# EAGLE design LED_CUBE_V4 (EAGLE 8.4.0)
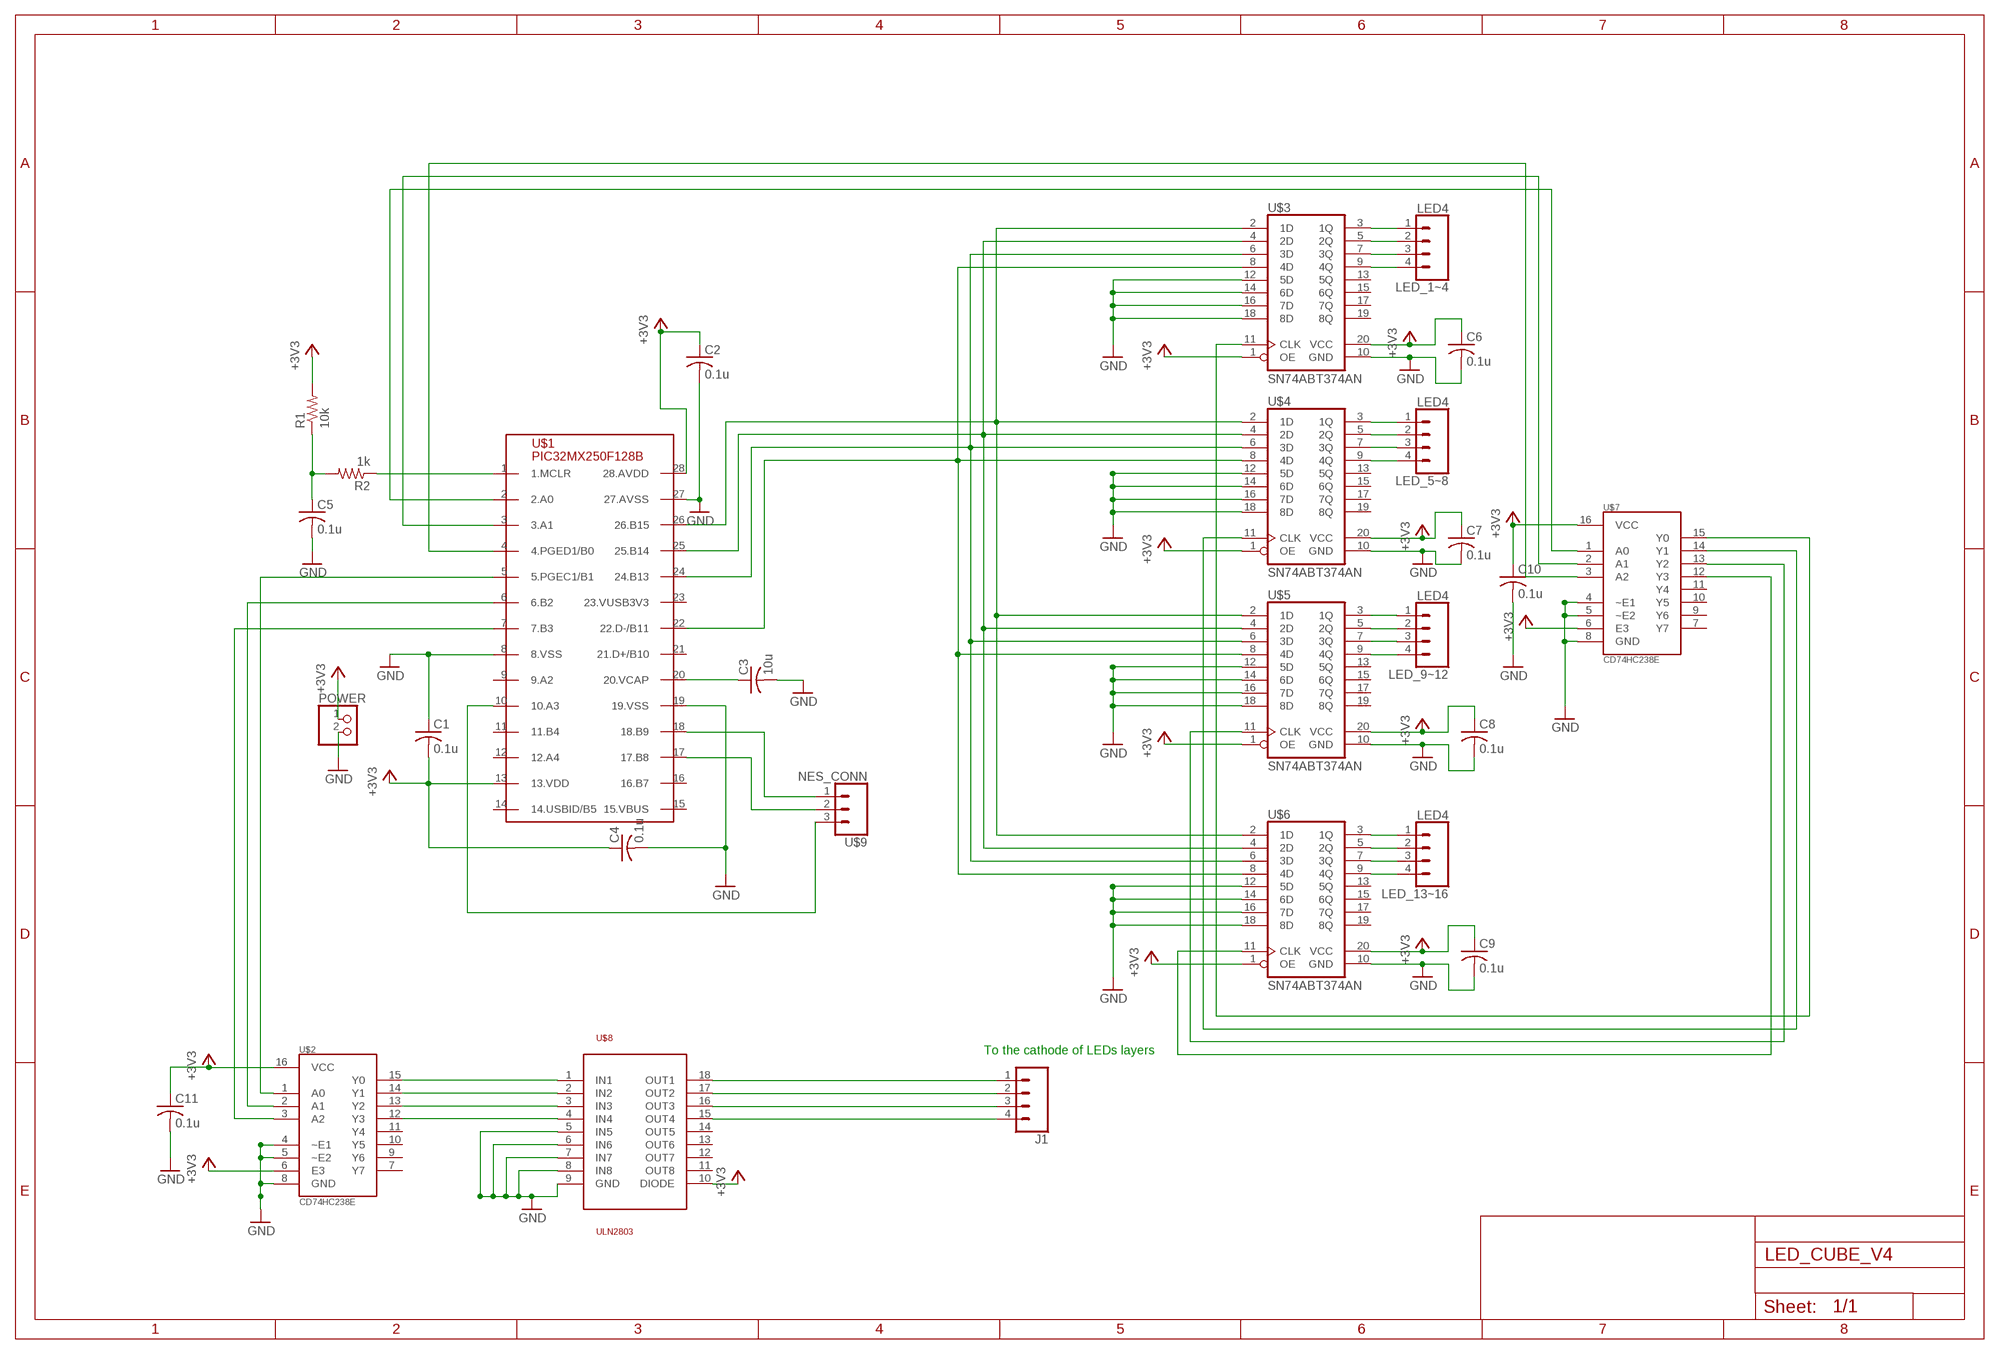
[diagram p0: schematic, sheet 1]

## Parts
C1  0.1u  C-US025-025X050  [C025-025X050]
C2  0.1u  C-US025-025X050  [C025-025X050]
C3  10u  C-US025-025X050  [C025-025X050]
C4  0.1u  C-US025-025X050  [C025-025X050]
C5  0.1u  C-US025-025X050  [C025-025X050]
C6  0.1u  C-US025-025X050  [C025-025X050]
C7  0.1u  C-US025-025X050  [C025-025X050]
C8  0.1u  C-US025-025X050  [C025-025X050]
C9  0.1u  C-US025-025X050  [C025-025X050]
C10  0.1u  C-US025-025X050  [C025-025X050]
C11  0.1u  C-US025-025X050  [C025-025X050]
J1  CONN_04  [1X04]
LED_1~4  LED4  [1X04]
LED_5~8  LED4  [1X04]
LED_9~12  LED4  [1X04]
LED_13~16  LED4  [1X04]
POWER  PINHD-1X2  [1X02]
R1  10k  R-US_0204/7  [0204/7]
R2  1k  R-US_0204/7  [0204/7]
U$1  PIC32MX250F128B  [DIL28-3]
U$2  CD74HC238E  [DIL16]
U$3  SN74ABT374AN  [DIL20]
U$4  SN74ABT374AN  [DIL20]
U$5  SN74ABT374AN  [DIL20]
U$6  SN74ABT374AN  [DIL20]
U$7  CD74HC238E  [DIL16]
U$8  ULN2803  [SO18L]
U$9  NES_CONN  [1X03]

## Nets
+3V3: C1.2 C2.1 C4.1 C6.1 C7.1 C8.1 C9.1 C10.1 C11.1 POWER.1 R1.2 U$1.13(13.VDD) U$1.28(28.AVDD) U$2.6(E3) U$2.16(VCC) U$3.1(OE) U$3.20(VCC) U$4.1(OE) U$4.20(VCC) U$5.1(OE) U$5.20(VCC) U$6.1(OE) U$6.20(VCC) U$7.6(E3) U$7.16(VCC) U$8.10(DIODE)
GND: C1.1 C2.2 C3.2 C4.2 C5.2 C6.2 C7.2 C8.2 C9.2 C10.2 C11.2 POWER.2 U$1.8(8.VSS) U$1.19(19.VSS) U$1.27(27.AVSS) U$2.4(~E1) U$2.5(~E2) U$2.8(GND) U$3.10(GND) U$3.12(5D) U$3.14(6D) U$3.16(7D) U$3.18(8D) U$4.10(GND) U$4.12(5D) U$4.14(6D) U$4.16(7D) U$4.18(8D) U$5.10(GND) U$5.12(5D) U$5.14(6D) U$5.16(7D) U$5.18(8D) U$6.10(GND) U$6.12(5D) U$6.14(6D) U$6.16(7D) U$6.18(8D) U$7.4(~E1) U$7.5(~E2) U$7.8(GND) U$8.5(IN5) U$8.6(IN6) U$8.7(IN7) U$8.8(IN8) U$8.9(GND)
LED1: LED_1~4.1 U$3.3(1Q)
N$1: U$2.15(Y0) U$8.1(IN1)
N$2: U$2.14(Y1) U$8.2(IN2)
N$3: U$2.13(Y2) U$8.3(IN3)
N$4: U$2.12(Y3) U$8.4(IN4)
N$5: U$1.10(10.A3) U$9.3
N$6: U$1.17(17.B8) U$9.2
N$7: U$1.18(18.B9) U$9.1
N$9: J1.1 U$8.18(OUT1)
N$10: J1.2 U$8.17(OUT2)
N$11: J1.3 U$8.16(OUT3)
N$12: J1.4 U$8.15(OUT4)
N$16: C3.1 U$1.20(20.VCAP)
N$17: U$1.5(5.PGEC1/B1) U$2.1(A0)
N$18: U$1.6(6.B2) U$2.2(A1)
N$19: U$1.7(7.B3) U$2.3(A2)
N$20: LED_9~12.1 U$5.3(1Q)
N$22: U$1.26(26.B15) U$3.2(1D) U$4.2(1D) U$5.2(1D) U$6.2(1D)
N$23: U$1.25(25.B14) U$3.4(2D) U$4.4(2D) U$5.4(2D) U$6.4(2D)
N$24: U$1.22(22.D-/B11) U$3.8(4D) U$4.8(4D) U$5.8(4D) U$6.8(4D)
N$25: U$1.24(24.B13) U$3.6(3D) U$4.6(3D) U$5.6(3D) U$6.6(3D)
N$28: C5.1 R1.1 R2.2
N$29: R2.1 U$1.1(1.MCLR)
N$31: U$3.11(CLK) U$7.15(Y0)
N$32: U$4.11(CLK) U$7.14(Y1)
N$33: U$1.3(3.A1) U$7.2(A1)
N$34: U$1.4(4.PGED1/B0) U$7.3(A2)
N$35: U$5.11(CLK) U$7.13(Y2)
N$36: U$6.11(CLK) U$7.12(Y3)
N$38: LED_9~12.2 U$5.5(2Q)
N$39: U$1.2(2.A0) U$7.1(A0)
N$40: LED_1~4.2 U$3.5(2Q)
N$41: LED_1~4.3 U$3.7(3Q)
N$42: LED_1~4.4 U$3.9(4Q)
N$43: LED_9~12.3 U$5.7(3Q)
N$44: LED_9~12.4 U$5.9(4Q)
N$47: LED_5~8.1 U$4.3(1Q)
N$48: LED_5~8.2 U$4.5(2Q)
N$49: LED_5~8.3 U$4.7(3Q)
N$50: LED_5~8.4 U$4.9(4Q)
N$63: LED_13~16.1 U$6.3(1Q)
N$64: LED_13~16.2 U$6.5(2Q)
N$65: LED_13~16.3 U$6.7(3Q)
N$66: LED_13~16.4 U$6.9(4Q)
Unconnected: U$1.9(9.A2) U$1.11(11.B4) U$1.12(12.A4) U$1.14(14.USBID/B5) U$1.15(15.VBUS) U$1.16(16.B7) U$1.21(21.D+/B10) U$1.23(23.VUSB3V3) U$2.7(Y7) U$2.9(Y6) U$2.10(Y5) U$2.11(Y4) U$3.13(5Q) U$3.15(6Q) U$3.17(7Q) U$3.19(8Q) U$4.13(5Q) U$4.15(6Q) U$4.17(7Q) U$4.19(8Q) U$5.13(5Q) U$5.15(6Q) U$5.17(7Q) U$5.19(8Q) U$6.13(5Q) U$6.15(6Q) U$6.17(7Q) U$6.19(8Q) U$7.7(Y7) U$7.9(Y6) U$7.10(Y5) U$7.11(Y4) U$8.11(OUT8) U$8.12(OUT7) U$8.13(OUT6) U$8.14(OUT5)

## Notes on the sheet
- To the cathode of LEDs layers

## Library data of the parts
C1-C11 = resistor:C-US: CAPACITOR, American symbol
J1 = SparkFun-Connectors:CONN_04: Multi connection point. Often used as Generic Header-pin footprint for 0.1 inch spaced/style header connections On any of the 0.1 inch spaced packages, you can populate with these: Break Away Headers - Straight <https://www.sparkfun.com/products/116> (PRT-00116) Break Away Male Headers - Right Angle <https://www.sparkfun.com/products/553> (PRT-00553) Female Headers <https://www.sparkfun.com/products/115> (PRT-00115) Break Away Headers - Machine Pin <https://www.sparkfun.com/products/117> (PRT-00117) Break Away Female Headers - Swiss Machine Pin <https://www.sparkfun.com/products/743> (PRT-00743) For SCREWTERMINALS and SPRING TERMINALS visit here: Screw Terimnals on SparkFun.com <https://www.sparkfun.com/search/results?term=Screw+Terminals> (5mm/3.5mm/2.54mm spacing) This device is also useful as a general connection point to wire up your design to another part of your project. Our various solder wires solder well into these plated through hole pads. Hook-Up Wire - Assortment (Stranded, 22 AWG) <https://www.sparkfun.com/products/11375> (PRT-11375) Hook-Up Wire - Assortment (Solid Core, 22 AWG) <https://www.sparkfun.com/products/11367> (PRT-11367) View the entire wire category on our website here <https://www.sparkfun.com/categories/141> Special notes: Molex polarized connector foot print use with SKU : PRT-08231 with associated crimp pins and housings. 1MM SMD Version SKU: PRT-10208; PROD_ID: CONN-09696
LED_1~4 LED_5~8 LED_9~12 LED_13~16 = ECE411:LED4
POWER = pinhead:PINHD-1X2: PIN HEADER
R1 R2 = resistor:R-US_: RESISTOR, American symbol
U$1 = ECE411:PIC32MX250F128B
U$2 U$7 = ECE411:CD74HC238E
U$3-U$6 = ECE411:SN74ABT374AN
U$8 = uln2803:ULN2803
U$9 = ECE411:NES_CONN

## Net classes
0 default: width 0.305 mm, drill 0.508 mm, clearance 0.254 mm

## Board
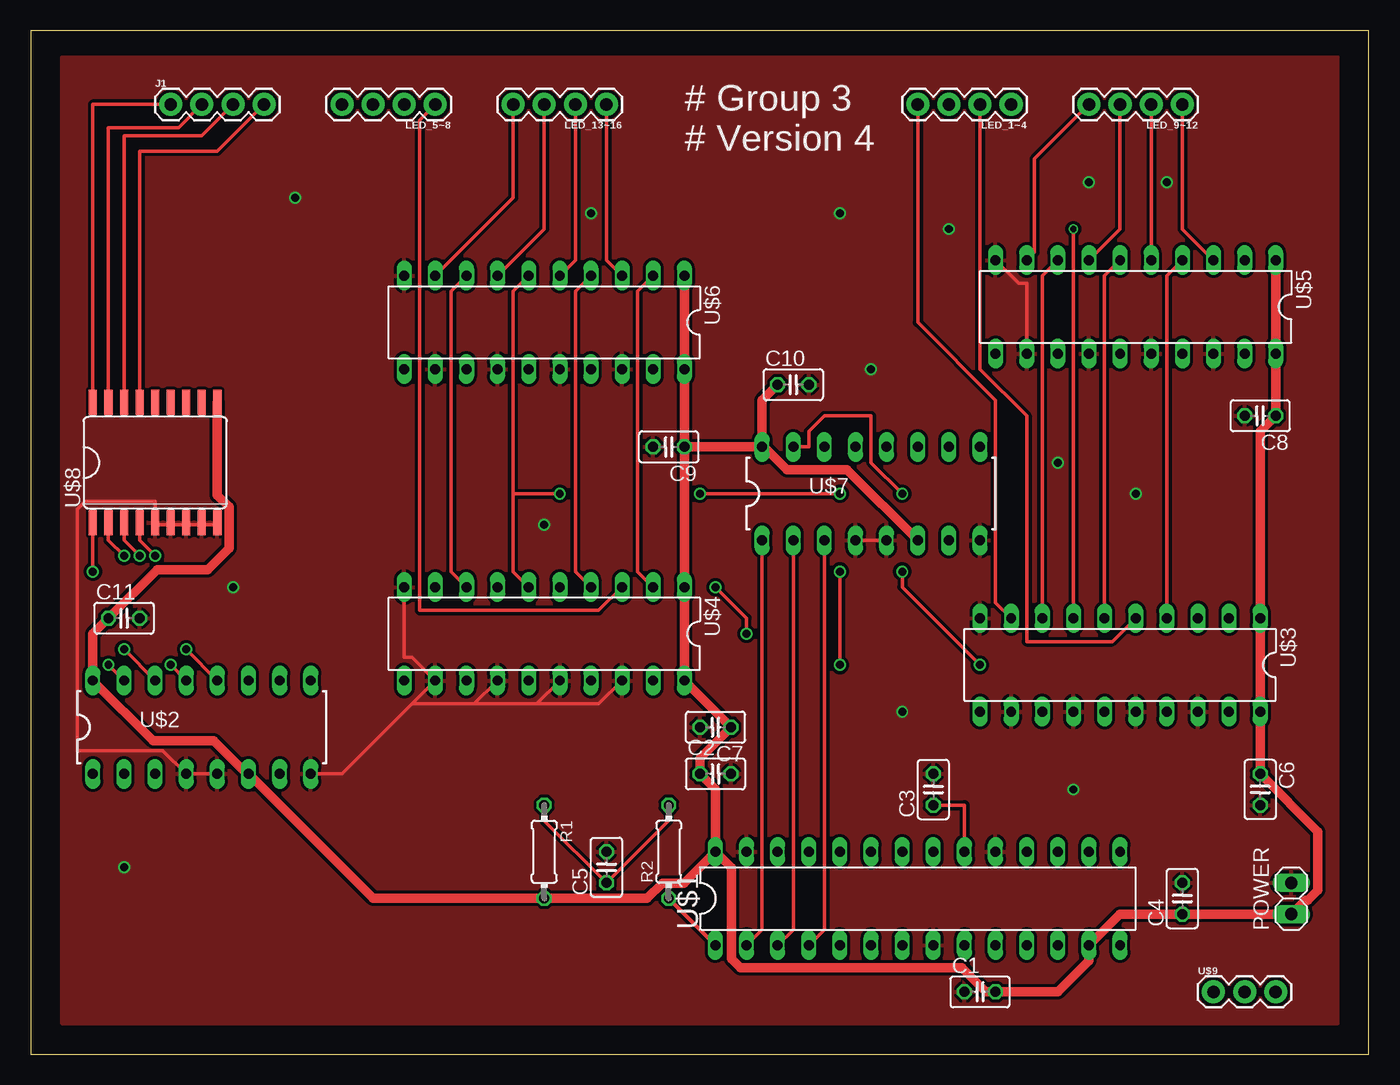
[diagram p1: board, top side]
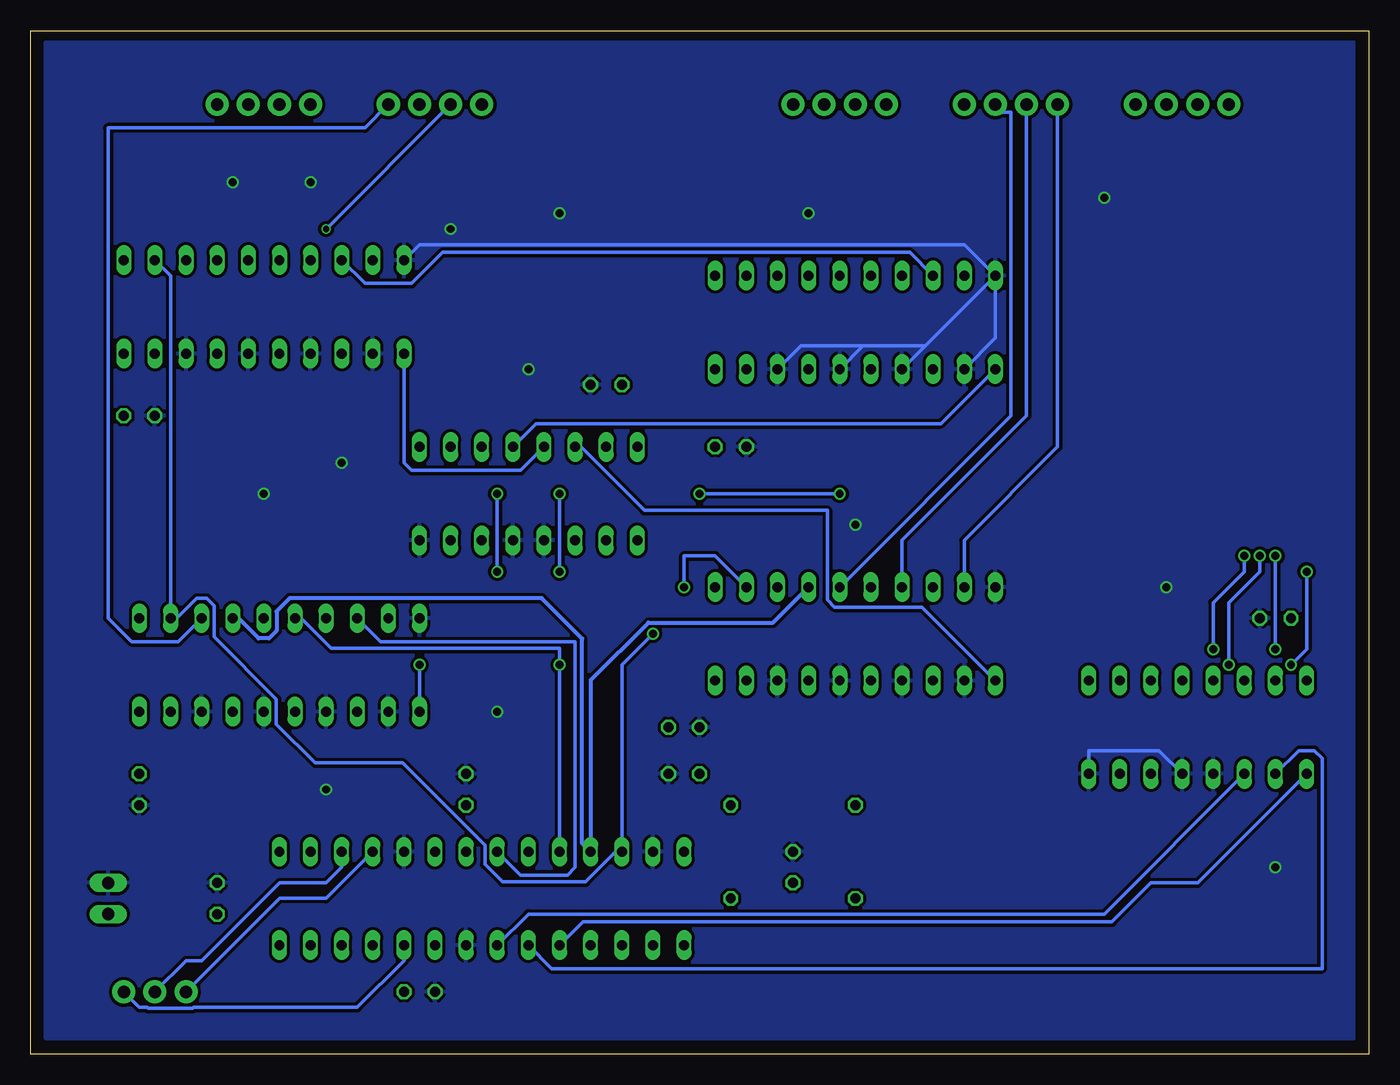
[diagram p2: board, bottom side, seen from below]

Size 109.2 x 83.49 mm. Coordinates in mm from the lower left corner, seen from the top.
Outline: 0,0 109.2,0 109.2,83.49 0,83.49 0,0
Copper layers (1*16): Top 0.035559375mm / dielectric 1.6mm / Bottom 0.035559375mm
Design rules "oshpark-2layer": minimum track width 6mil, minimum drill 10mil, track to track 6mil, track to pad 6mil, pad to pad 6mil, via to via 6mil, smd to smd 6mil, copper to edge 15mil, drill to drill 6mil, minimum pad ring 5mil, minimum via ring 5mil, stop-mask expansion 2.5mil, vias tented up to drill 0mil, thermal gap 10mil

### Footprints (pad centres in the part's own frame; a part is rotated, then mirrored left to right if it is on the bottom)
C025-025X050 = drill 0.813 octagon: 1 -1.27,0; 2 1.27,0
1X04 = drill 1.016 pad 1.88: 1 0,0; 2 2.54,0; 3 5.08,0; 4 7.62,0
1X02 = drill 1.016 long: 1 -1.27,0; 2 1.27,0
0204/7 = drill 0.813 octagon: 1 -3.81,0; 2 3.81,0
DIL28-3 = drill 0.813 long: 1 -16.51,-3.81; 2 -13.97,-3.81; 3 -11.43,-3.81; 4 -8.89,-3.81; 5 -6.35,-3.81; 6 -3.81,-3.81; 7 -1.27,-3.81; 8 1.27,-3.81; 9 3.81,-3.81; 10 6.35,-3.81; 11 8.89,-3.81; 12 11.43,-3.81; 13 13.97,-3.81; 14 16.51,-3.81; 15 16.51,3.81; 16 13.97,3.81; 17 11.43,3.81; 18 8.89,3.81; 19 6.35,3.81; 20 3.81,3.81; 21 1.27,3.81; 22 -1.27,3.81; 23 -3.81,3.81; 24 -6.35,3.81; 25 -8.89,3.81; 26 -11.43,3.81; 27 -13.97,3.81; 28 -16.51,3.81
DIL16 = drill 0.813 long: 1 -8.89,-3.81; 2 -6.35,-3.81; 3 -3.81,-3.81; 4 -1.27,-3.81; 5 1.27,-3.81; 6 3.81,-3.81; 7 6.35,-3.81; 8 8.89,-3.81; 9 8.89,3.81; 10 6.35,3.81; 11 3.81,3.81; 12 1.27,3.81; 13 -1.27,3.81; 14 -3.81,3.81; 15 -6.35,3.81; 16 -8.89,3.81
DIL20 = drill 0.813 long: 1 -11.43,-3.81; 2 -8.89,-3.81; 3 -6.35,-3.81; 4 -3.81,-3.81; 5 -1.27,-3.81; 6 1.27,-3.81; 7 3.81,-3.81; 8 6.35,-3.81; 9 8.89,-3.81; 10 11.43,-3.81; 11 11.43,3.81; 12 8.89,3.81; 13 6.35,3.81; 14 3.81,3.81; 15 1.27,3.81; 16 -1.27,3.81; 17 -3.81,3.81; 18 -6.35,3.81; 19 -8.89,3.81; 20 -11.43,3.81
SO18L = smd 0.66 x 2.032: 1 -5.08,-4.902; 2 -3.81,-4.902; 3 -2.54,-4.902; 4 -1.27,-4.902; 5 0,-4.902; 6 1.27,-4.902; 7 2.54,-4.902; 8 3.81,-4.902; 9 5.08,-4.902; 10 5.08,4.902; 11 3.81,4.902; 12 2.54,4.902; 13 1.27,4.902; 14 0,4.902; 15 -1.27,4.902; 16 -2.54,4.902; 17 -3.81,4.902; 18 -5.08,4.902
1X03 = drill 1.016 pad 1.88: 1 0,0; 2 2.54,0; 3 5.08,0

### Placement (x,y rotation side)
C1  77.47,5.08 0 top
C2  55.88,22.86 0 top
C3  73.66,21.59 90 top
C4  93.98,12.7 90 top
C5  46.99,15.24 90 top
C6  100.33,21.59 270 top
C7  55.88,26.67 180 top
C8  100.33,52.07 180 top
C9  52.07,49.53 180 top
C10  62.23,54.61 0 top
C11  7.62,35.56 0 top
J1  11.43,77.47 0 top
LED_1~4  80.01,77.47 180 top
LED_5~8  33.02,77.47 180 top
LED_9~12  93.98,77.47 180 top
LED_13~16  46.99,77.47 180 top
POWER  102.87,12.7 90 top
R1  41.91,16.51 270 top
R2  52.07,16.51 90 top
U$1  72.39,12.7 0 top
U$2  13.97,26.67 0 top
U$3  88.9,31.75 180 top
U$4  41.91,34.29 180 top
U$5  90.17,60.96 180 top
U$6  41.91,59.69 180 top
U$7  68.58,45.72 0 top
U$8  10.16,48.26 0 top
U$9  96.52,5.08 0 top

### Tracks (layer width: path | path; a pad name or v marks a point on that pad's centre or on a via)
+3V3
  Top 0.762: U$1.28 55.88,21.59 C2.1 54.61,24.13 C7.1 U$4.20 U$4.1 C9.1 | C9.1 U$6.20 U$6.1 | U$7.16 59.69,53.34 C10.1 | U$5.1 U$5.20 C8.1 100.33,50.8 U$3.1 U$3.20 C6.1 105.03,18.16 105.03,13.39 104.21,12.57 104.01,12.57 POWER.1 C4.1 88.9,11.43 U$1.13 86.36,7.62 83.82,5.08 C1.2 77.96,5.08 76,7.04 57.9,7.04 57.17,7.76 57.17,15.21 U$1.28 | U$7.16 C9.1 | U$7.16 59.86,49.53 61.71,47.68 66.62,47.68 U$7.6 | U$1.28 53.31,13.95 51.55,13.95 50.31,12.7 R1.2 27.94,12.7 U$2.6 17.61,22.86 14.92,25.55 10.01,25.55 U$2.16 5.08,34.29 C11.1 10.31,39.52 14.44,39.52 16.2,41.29 16.2,44.64 15.24,45.6 U$8.10
GND  (via drill 0.65)
  Top 0.305: U$2.5 U$2.4 10.79,24.77 3.81,24.77 3.81,44.45 4.45,45.09 10.16,45.09 U$8.5 10.16,43.18 11.43,43.18 | 31.11,28.57 25.4,22.86 U$2.8 | 31.11,28.57 U$4.12 31.11,32.38 30.48,32.38 U$4.10 | 36.2,28.57 U$4.14 | 31.11,28.57 36.2,28.57 | 41.27,28.57 U$4.16 | 36.2,28.57 41.27,28.57 | U$4.18 46.35,28.57 41.27,28.57 | U$5.12 81.28,62.87 80.64,62.87 U$5.10 | 11.43,43.18 12.7,43.18 | 11.43,43.18 U$8.6 | 12.7,43.18 13.97,43.18 | 12.7,43.18 U$8.7 | 13.97,43.18 15.24,43.18 U$8.9 | 13.97,43.18 U$8.8 | U$7.5 U$7.4
  Bottom 0.305: U$5.10 77.47,66.04 33.02,66.04 U$6.10 | U$6.12 30.48,58.42 U$6.10 | U$6.10 36.2,57.78 | 36.2,57.78 U$6.14 | 41.27,57.78 U$6.16 | 36.2,57.78 41.27,57.78 | U$6.18 46.35,57.78 41.27,57.78 | U$2.5 17.14,24.77 22.86,24.77 U$2.8
  other vias: 66.04,68.58 85.09,21.59 16.51,38.1 7.62,15.24 21.59,69.85 74.93,67.31 90.17,45.72 71.12,27.94 68.58,55.88 45.72,68.58 41.91,43.18 86.36,71.12 92.71,71.12 83.82,48.26
  pour Top: 2.54,78.74 2.54,2.54 106.68,2.54 106.68,81.28 87.63,81.28 2.54,81.28
  pour Bottom: 1.27,82.55 1.27,1.27 2.54,1.27 107.95,1.27 107.95,82.55 105.41,82.55
LED1
  Bottom 0.305: U$3.3 97.16,33.66 100.97,33.66 102.87,35.56 102.87,75.56 81.92,75.56 LED_1~4.1
N$1  (via drill 0.65)
  Top 0.305: v6.35,31.75 U$2.15 | U$8.1 v5.08,39.37
  Bottom 0.305: v6.35,31.75 5.08,33.02 v5.08,39.37
N$2  (via drill 0.65)
  Top 0.305: v7.62,33.02 U$2.14 | v7.62,40.64 6.35,41.91 U$8.2
  Bottom 0.305: v7.62,40.64 v7.62,33.02
N$3  (via drill 0.65)
  Top 0.305: v11.43,31.75 U$2.13 | v8.89,40.64 7.62,41.91 U$8.3
  Bottom 0.305: v11.43,31.75 11.43,36.83 8.89,39.37 v8.89,40.64
N$4  (via drill 0.65)
  Top 0.305: v12.7,33.02 U$2.12 | v10.16,40.64 8.89,41.91 U$8.4
  Bottom 0.305: v12.7,33.02 12.7,36.83 10.16,39.37 v10.16,40.64
N$5
  Bottom 0.305: U$9.3 100.33,3.81 99.69,3.81 99.62,3.73 95.96,3.73 95.89,3.81 82.55,3.81 78.74,7.62 U$1.10
N$6
  Bottom 0.305: U$9.2 96.52,7.62 95.25,7.62 88.9,13.97 85.09,13.97 83.82,15.24 U$1.17
N$7
  Bottom 0.305: U$1.18 85.09,12.7 88.9,12.7 U$9.1
N$9
  Top 0.305: U$8.18 5.08,77.47 J1.1
N$10
  Top 0.305: U$8.17 6.35,75.56 12.06,75.56 J1.2
N$11
  Top 0.305: U$8.16 7.62,74.93 13.97,74.93 J1.3
N$12
  Top 0.305: U$8.15 8.89,73.66 15.24,73.66 J1.4
N$16
  Top 0.305: C3.1 76.2,20.32 U$1.20
N$17
  Bottom 0.305: U$2.1 13.97,13.97 17.78,13.97 20.95,10.79 64.14,10.79 U$1.5
N$18
  Bottom 0.305: U$2.2 5.71,24.77 4.45,24.77 3.81,24.13 3.81,6.99 66.67,6.99 U$1.6
N$19
  Bottom 0.305: U$2.3 21.59,11.43 68.58,11.43 U$1.7
N$20
  Top 0.305: U$5.3 93.98,67.31 LED_9~12.1
N$22  (via drill 0.65)
  Top 0.305: U$4.2 49.53,39.37 49.53,62.23 U$6.2 | v55.88,38.1 58.42,35.56 v58.42,34.29
  Bottom 0.305: U$5.2 97.79,63.5 U$3.2 97.3,35.56 95.67,37.19 94.83,37.19 94.23,36.59 94.23,34.05 89.15,28.97 89.15,26.92 85.98,23.75 78.86,23.75 72.14,17.03 72.14,15.48 70.7,14.05 63.92,14.05 61.45,16.51 U$1.26 60.96,31.75 v58.42,34.29 | U$4.2 53.34,40.64 55.88,40.64 v55.88,38.1
N$23
  Top 0.305: U$3.4 92.71,63.5 U$5.4 | U$6.4 44.45,62.23 44.45,39.37 U$4.4
  Bottom 0.33: U$4.4 48.62,35.2 58.8,35.2 63.5,30.49 U$1.25 64.2,17.21 64.2,33.89 67.5,37.2 88.06,37.2 89.14,36.11 89.14,34.52 89.74,33.92 90.6,33.92 92.23,35.56 U$3.4
N$24
  Top 0.305: U$4.8 34.29,39.37 34.29,62.23 U$6.8 | U$5.8 82.55,63.5 U$3.8
  Bottom 0.305: U$1.22 69.22,14.61 65.41,14.61 64.77,15.24 64.77,33.66 80.64,33.66 U$3.8 | U$6.8 37.47,65.41 75.56,65.41 78.11,62.87 81.92,62.87 U$5.8
N$25  (via drill 0.65)
  Top 0.305: U$5.6 87.63,63.5 U$3.6 | U$4.6 39.37,39.37 39.37,45.72 | 39.37,45.72 39.37,62.23 U$6.6 | v66.04,39.37 v66.04,31.75 | v54.61,45.72 v66.04,45.72 | 39.37,45.72 v43.18,45.72
  Bottom 0.305: U$1.24 v66.04,31.75 66.04,33.1 84.67,33.1 87.14,35.56 U$3.6 | v66.04,45.72 v66.04,39.37 | v43.18,45.72 v54.61,45.72
N$28
  Top 0.305: R1.1 41.91,19.05 C5.1 52.07,19.05 R2.2
N$29
  Top 0.33: R2.1 U$1.1
N$31  (via drill 0.65)
  Top 0.305: v77.47,31.75 71.12,38.1 v71.12,39.37 | v71.12,45.72 68.58,48.26 68.58,52.07 64.77,52.07 63.5,50.8 63.5,49.53 U$7.15
  Bottom 0.305: v77.47,31.75 U$3.11 | v71.12,45.72 v71.12,39.37
N$32
  Bottom 0.305: U$7.14 64.28,49.53 59.11,44.36 44.2,44.36 44.2,37.07 43.6,36.47 36.47,36.47 U$4.11
N$33
  Top 0.305: U$1.3 62.23,10.16 U$7.2
N$34
  Top 0.305: U$1.4 64.77,10.16 U$7.3
N$35
  Bottom 0.305: U$7.13 69.22,47.62 78.11,47.62 78.74,48.26 U$5.11
N$36
  Bottom 0.305: U$6.11 34.92,51.44 67.94,51.44 U$7.12
N$38
  Top 0.305: LED_9~12.2 U$5.5
N$39
  Top 0.305: U$1.2 59.69,10.16 U$7.1
N$40
  Top 0.305: U$3.5 88.27,33.66 81.28,33.66 81.28,52.07 77.47,55.88 LED_1~4.2
N$41  (via drill 0.51)
  Top 0.305: v85.09,67.31 U$3.7
  Bottom 0.305: LED_1~4.3 v85.09,67.31
N$42
  Top 0.305: U$3.9 78.74,36.83 78.74,53.34 72.39,59.69 LED_1~4.4
N$43
  Top 0.305: U$5.7 88.9,67.31 LED_9~12.3
N$44
  Top 0.305: U$5.9 81.92,65.41 81.92,73.03 LED_9~12.4
N$47
  Top 0.305: U$4.3 46.35,36.2 31.75,36.2 31.75,76.2 LED_5~8.1
N$48
  Bottom 0.305: U$4.5 29.21,52.07 29.21,76.83 29.84,76.83 LED_5~8.2
N$49
  Bottom 0.305: U$4.7 38.1,41.91 27.94,52.07 LED_5~8.3
N$50
  Bottom 0.305: U$4.9 33.02,41.91 25.4,49.53 LED_5~8.4
N$63
  Top 0.305: U$6.3 46.99,64.77 LED_13~16.1
N$64
  Top 0.305: U$6.5 44.45,64.77 LED_13~16.2
N$65
  Top 0.305: U$6.7 41.91,67.31 LED_13~16.3
N$66
  Top 0.305: U$6.9 39.37,69.85 LED_13~16.4

### Text on the board
tPlace: # Group 3 / # Version 4